# EAGLE design Master (EAGLE 7.5.0)
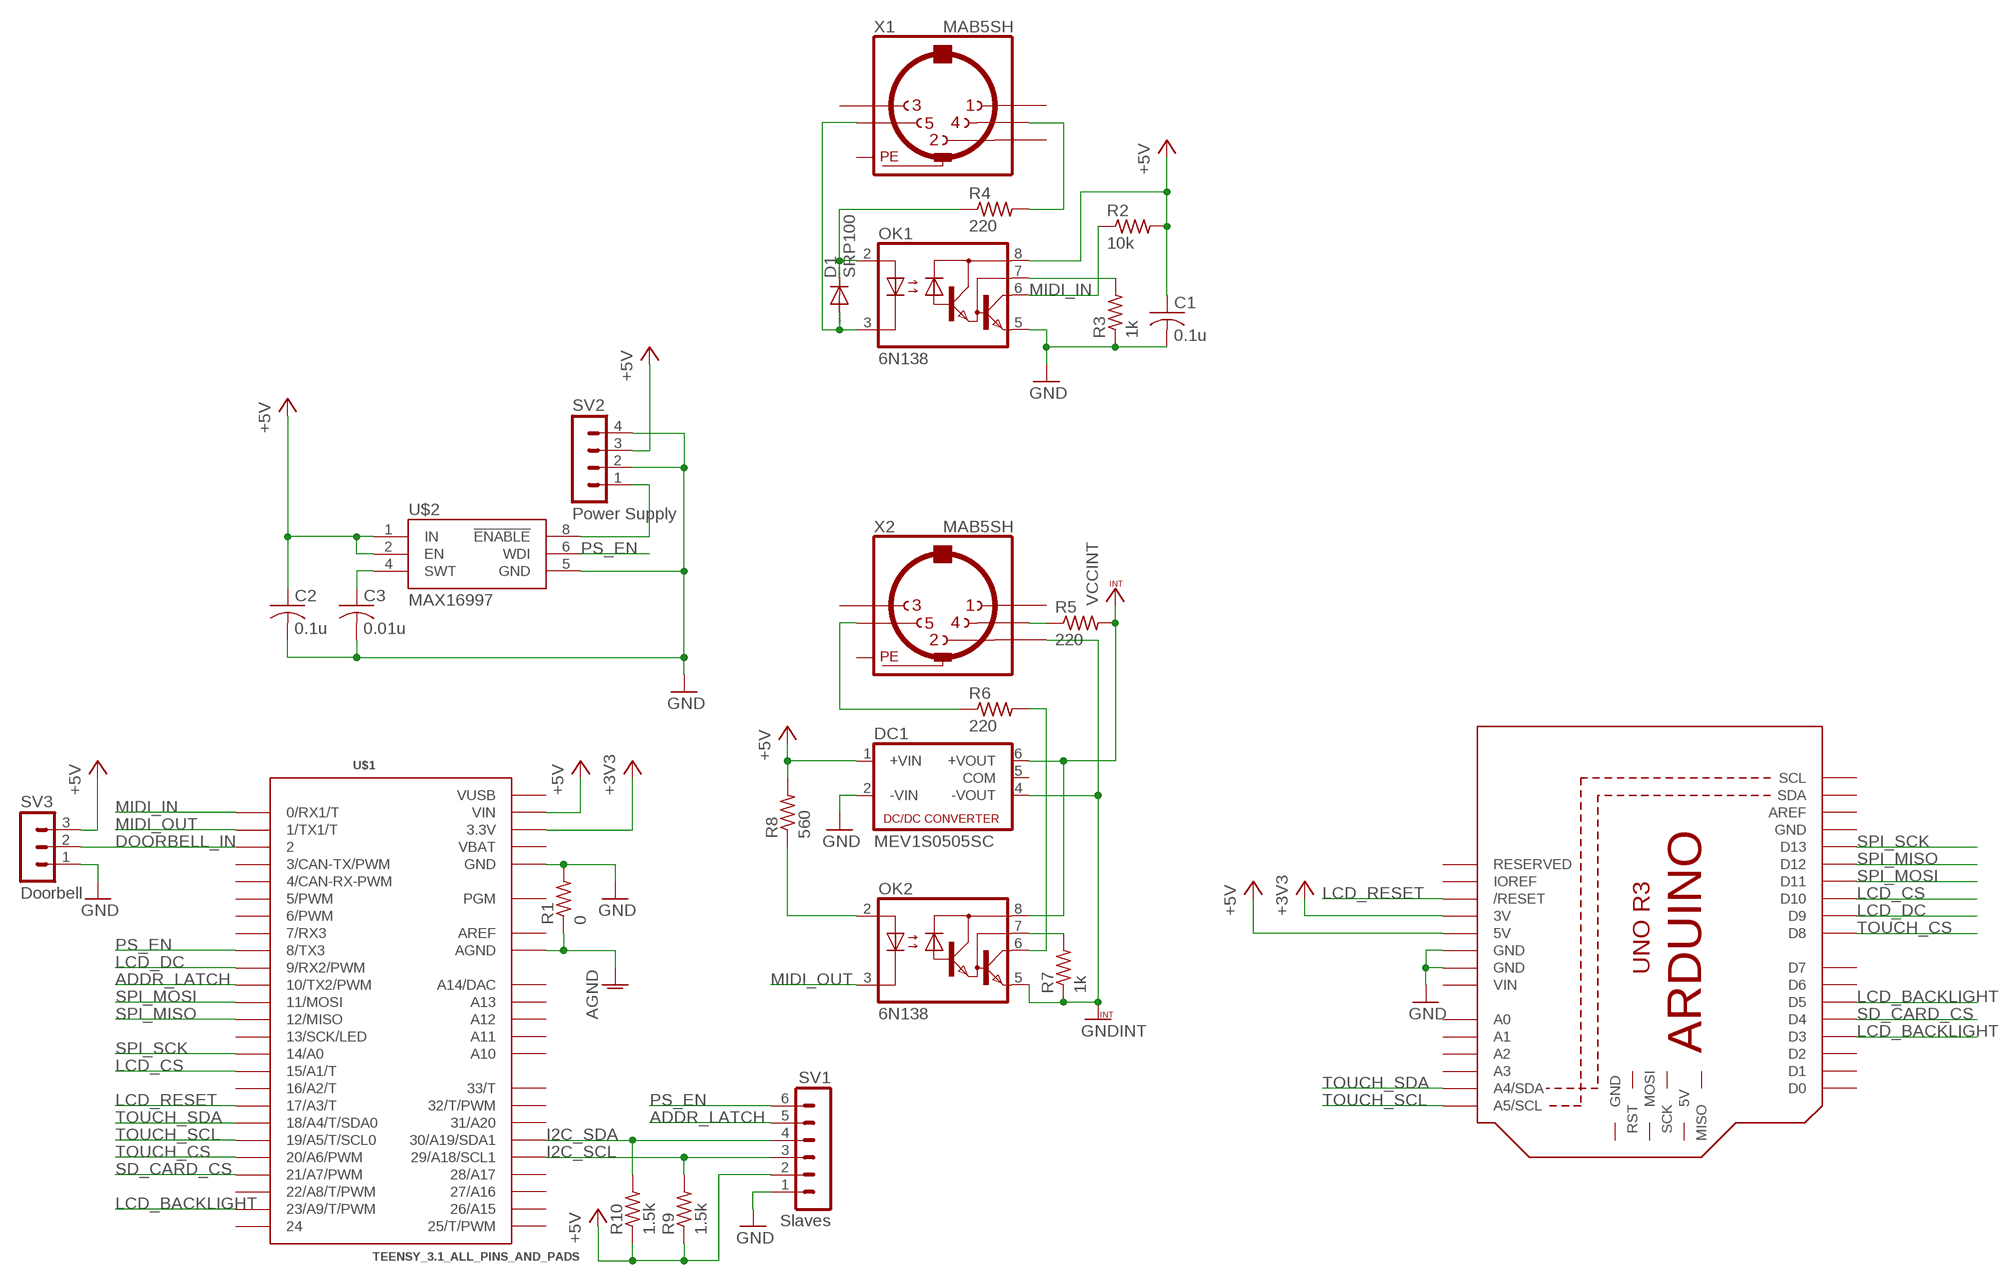
[diagram p0: schematic, sheet 1]

## Parts
C1  0.1u  C-USC0805  [C0805]
C2  0.1u  C-USC0805  [C0805]
C3  0.01u  C-USC0805  [C0805]
D1  SRP100  [DO41-10]
DC1  MEV1S0505SC  NMA  [NMA]
M1  ARDUINO_R3_ICSP_NODIM  [ARDUINOR3_ICSP_NODIM]
OK1  6N138  [DIL08]
OK2  6N138  [DIL08]
R1  0  R-US_R0805  [R0805]
R2  10k  R-US_R0805  [R0805]
R3  1k  R-US_R0805  [R0805]
R4  220  R-US_R0805  [R0805]
R5  220  R-US_R0805  [R0805]
R6  220  R-US_R0805  [R0805]
R7  1k  R-US_R0805  [R0805]
R8  560  R-US_R0805  [R0805]
R9  1.5k  R-US_R0805  [R0805]
R10  1.5k  R-US_R0805  [R0805]
SV1  Slaves  MA06-1  [MA06-1]
SV2  Power Supply  MA04-1  [MA04-1]
SV3  Doorbell  MA03-1  [MA03-1]
U$1  TEENSY_3.1_ALL_PINS_AND_PADS  [TEENSY3_ALL_PINS_&_PADS]
U$2  MAX16997  [UMAX-U8-1]
X1  MAB5SH  [MAB5SH]
X2  MAB5SH  [MAB5SH]

## Nets
+3V3: M1.3V U$1.3.3V U$1.3.3V1(3.3V) U$1.3.3V2(3.3V)
+5V: C1.1 C2.1 DC1.1(+VIN) M1.5V OK1.8(VCC) R2.2 R8.2 R9.1 R10.1 SV1.2 SV2.3 SV3.3 U$1.VIN U$2.1(IN) U$2.2(EN)
ADDR_LATCH: SV1.5 U$1.10(10/TX2/PWM)
AGND: R1.1 U$1.AGND
DOORBELL_IN: SV3.2 U$1.2
GND: C1.2 C2.2 C3.2 DC1.2(-VIN) M1.GND@1(GND) M1.GND@3(GND) OK1.5(GND) R1.2 R3.1 SV1.1 SV2.2 SV2.4 SV3.1 U$1.GND U$1.GND1(GND) U$1.GND2(GND) U$2.5(GND)
GNDINT: DC1.4(-VOUT) OK2.5(GND) R7.1 X2.2
I2C_SCL: R9.2 SV1.3 U$1.29(29/A18/SCL1)
I2C_SDA: R10.2 SV1.4 U$1.30(30/A19/SDA1)
LCD_BACKLIGHT: M1.D3 M1.D5 U$1.23/A9(23/A9/T/PWM)
LCD_CS: M1.D10 U$1.15/A1(15/A1/T)
LCD_DC: M1.D9 U$1.9(9/RX2/PWM)
LCD_RESET: M1.RESET(/RESET) U$1.17/A3(17/A3/T)
MIDI_IN: OK1.6(VO) R2.1 U$1.0(0/RX1/T)
MIDI_OUT: OK2.3(C) U$1.1(1/TX1/T)
N$1: R6.1 X2.5
N$2: OK1.7(VB) R3.2
N$3: D1.C OK1.2(A) R4.1
N$4: R4.2 X1.4
N$5: D1.A OK1.3(C) X1.5
N$6: OK2.6(VO) R6.2
N$7: R5.1 X2.4
N$8: C3.1 U$2.4(SWT)
N$9: OK2.2(A) R8.1
N$10: OK2.7(VB) R7.2
N$11: SV2.1 U$2.8(!ENABLE)
PS_EN: SV1.6 U$1.8(8/TX3) U$2.6(WDI)
SD_CARD_CS: M1.D4 U$1.21/A7(21/A7/PWM)
SPI_MISO: M1.D12 U$1.12(12/MISO)
SPI_MOSI: M1.D11 U$1.11(11/MOSI)
SPI_SCK: M1.D13 U$1.14/A0
TOUCH_CS: M1.D8 U$1.20/A6(20/A6/PWM)
TOUCH_SCL: M1.A5(A5/SCL) U$1.19/A5(19/A5/T/SCL0)
TOUCH_SDA: M1.A4(A4/SDA) U$1.18/A4(18/A4/T/SDA0)
VCCINT: DC1.6(+VOUT) OK2.8(VCC) R5.2
Unconnected: DC1.5(COM) M1.5V_ICSP(5V) M1.A0 M1.A1 M1.A2 M1.A3 M1.AREF M1.D0 M1.D1 M1.D2 M1.D6 M1.D7 M1.GND@2(GND) M1.IOREF M1.MISO M1.MOSI M1.RESERVED M1.RESET_ICSP(RST) M1.SCK M1.SCL M1.SDA U$1.3(3/CAN-TX/PWM) U$1.4(4/CAN-RX-PWM) U$1.5(5/PWM) U$1.6(6/PWM) U$1.7(7/RX3) U$1.13(13/SCK/LED) U$1.16/A2(16/A2/T) U$1.22/A8(22/A8/T/PWM) U$1.24 U$1.25(25/T/PWM) U$1.26(26/A15) U$1.27(27/A16) U$1.28(28/A17) U$1.31(31/A20) U$1.32(32/T/PWM) U$1.33(33/T) U$1.A10 U$1.A11 U$1.A12 U$1.A13 U$1.PGM U$1.RESET/DAC(A14/DAC) X1.1 X1.2 X1.3 X2.1 X2.3

## Power pins joined to a net without a drawn wire
AREF: U$1.AREF
GND: M1.GND
PE: X1.PE X1.PE@(PE) X2.PE X2.PE@(PE)
VBAT: U$1.VBAT
VIN: M1.VIN
VUSB: U$1.VUSB

## Library data of the parts
C1-C3 = resistor:C-US: CAPACITOR, American symbol
D1 = diode:SRP100: DIODE
DC1 = dc-dc-converter:NMA: DC-DC CONVERTER; MF: C & D TECHNOLOGIES, INC; MPN: NMA0515SC; OC_FARNELL: 1021434; OC_NEWARK: 61K3064
M1 = adafruit:ARDUINO_R3_ICSP
OK1 OK2 = optocoupler:6N138: MOTOROLA OPTO COUPLER; MF: VISHAY/TELEFUNKEN; MPN: 6N138; OC_FARNELL: 9860150; OC_NEWARK: 35K5294
R1-R10 = resistor:R-US_: RESISTOR, American symbol
SV1 = con-lstb:MA06-1: PIN HEADER; OC_FARNELL: unknown; OC_NEWARK: unknown
SV2 = con-lstb:MA04-1: PIN HEADER; OC_FARNELL: unknown; OC_NEWARK: unknown
SV3 = con-lstb:MA03-1: PIN HEADER; OC_FARNELL: unknown; OC_NEWARK: unknown
U$1 = Teensy_3_and_LC_Series_Boards_v1.1:TEENSY_3.1_ALL_PINS_AND_PADS: Footprint for Teensy 3.1 or 3.2 board using all pads and all through-holes. Pads need a 2x7 0.1" SMD header.
U$2 = DAVe3283:MAX16997: MAXIM MAX16997 Watchdog; MPN: MAX16997A
X1 X2 = con-hirschmann:MAB5SH: Female CONNECTOR 5 pins 90 deg. with shield, horizontal (DIN 41524); OC_FARNELL: 809883; OC_NEWARK: unknown

## Board
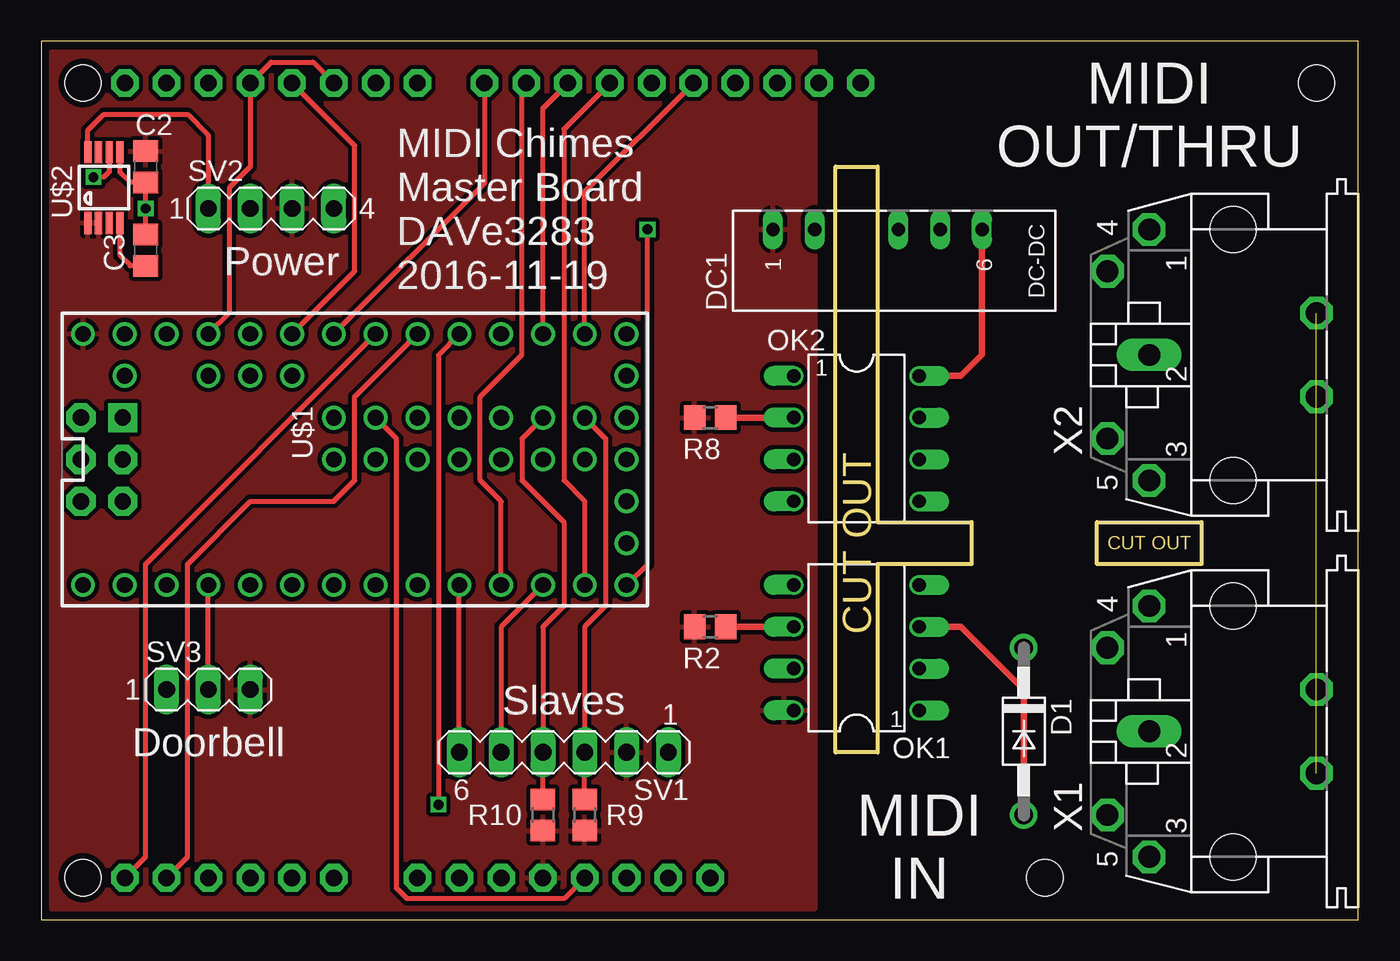
[diagram p1: board, top side]
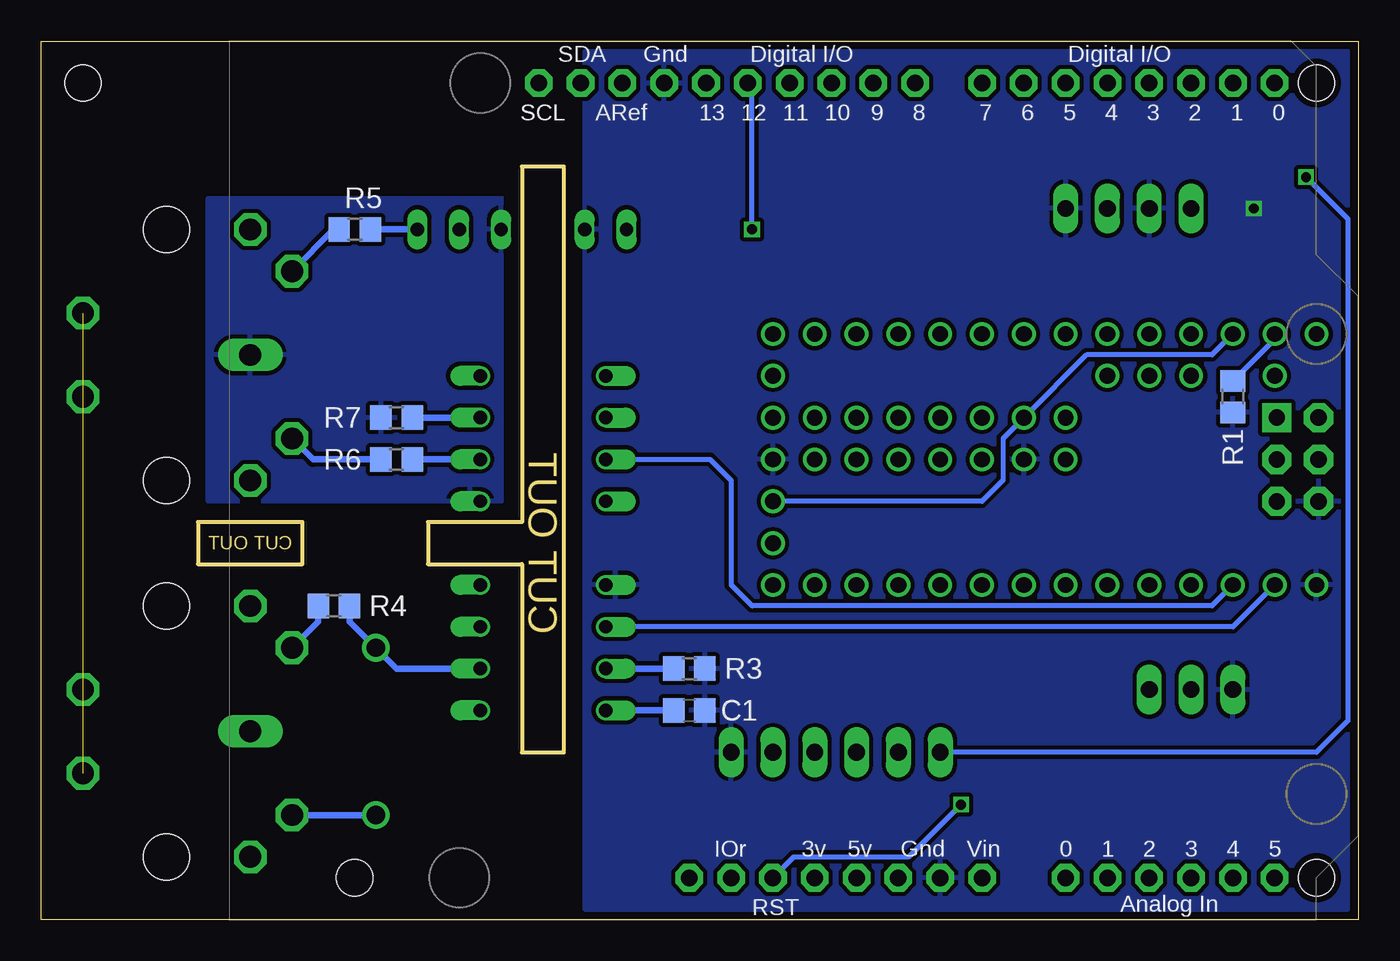
[diagram p2: board, bottom side, seen from below]

Size 80.01 x 53.34 mm. Coordinates in mm from the lower left corner, seen from the top.
Outline: 0,0 80.01,0 80.01,53.34 0,53.34 0,0
Outline: 48.26,45.72 50.8,45.72 50.8,24.13 56.52,24.13 56.52,21.59 50.8,21.59 50.8,10.16 48.26,10.16 48.26,45.72
Outline: 64.14,24.13 70.48,24.13 70.48,21.59 64.14,21.59 64.14,24.13
Copper layers (1*16): Top 0.0356mm / dielectric 1.5011mm / Bottom 0.0356mm
Design rules "OSH_Park": minimum track width 6mil, minimum drill 13mil, track to track 6mil, track to pad 6mil, pad to pad 6mil, via to via 6mil, smd to smd 6mil, copper to edge 15mil, drill to drill 6mil, minimum pad ring 7mil, minimum via ring 7mil, stop-mask expansion 3mil, vias tented up to drill 0mil, thermal gap 10mil
Holes 2.2 mm at 2.54,50.8 2.54,2.54 77.47,50.8 60.96,2.54

### Footprints (pad centres in the part's own frame; a part is rotated, then mirrored left to right if it is on the bottom)
C0805 = smd 1.3 x 1.5: 1 -0.95,0; 2 0.95,0
DO41-10 = drill 1.118: A 5.08,0; C -5.08,0
NMA = drill 0.813 long: 1 0,6.35; 2 0,3.81; 4 0,-1.27; 5 0,-3.81; 6 0,-6.35
ARDUINOR3_ICSP_NODIM = drill 1 pad 1.676 octagon: 3V 35.56,2.54; 5V 38.1,2.54; A0 50.8,2.54; A1 53.34,2.54; A2 55.88,2.54; A3 58.42,2.54; A4 60.96,2.54; A5 63.5,2.54; AREF 23.876,50.8; D0 63.5,50.8; D1 60.96,50.8; D2 58.42,50.8; D3 55.88,50.8; D4 53.34,50.8; D5 50.8,50.8; D6 48.26,50.8; D7 45.72,50.8; D8 41.656,50.8; D9 39.116,50.8; D10 36.576,50.8; D11 34.036,50.8; D12 31.496,50.8; D13 28.956,50.8; GND 26.416,50.8; GND@1 43.18,2.54; GND@2 40.64,2.54; IOREF 30.48,2.54; RESERVED 27.94,2.54; RESET 33.02,2.54; SCL 18.796,50.8; SDA 21.336,50.8; VIN 45.72,2.54 | drill 1 pad 1.778 octagon: 5V_ICSP 66.167,30.48; GND@3 66.167,25.4; MOSI 66.167,27.94; RESET_ICSP 63.627,25.4; SCK 63.627,27.94 | drill 1 pad 1.778 square: MISO 63.627,30.48
DIL08 = drill 0.813 offset: 1 -3.81,-3.81; 2 -1.27,-3.81; 3 1.27,-3.81; 4 3.81,-3.81; 5 3.81,3.81; 6 1.27,3.81; 7 -1.27,3.81; 8 -3.81,3.81
R0805 = smd 1.3 x 1.5: 1 -0.95,0; 2 0.95,0
MA06-1 = drill 1.016 long: 1 -6.35,0; 2 -3.81,0; 3 -1.27,0; 4 1.27,0; 5 3.81,0; 6 6.35,0
MA04-1 = drill 1.016 long: 1 -3.81,0; 2 -1.27,0; 3 1.27,0; 4 3.81,0
MA03-1 = drill 1.016 long: 1 -2.54,0; 2 0,0; 3 2.54,0
TEENSY3_ALL_PINS_&_PADS = drill 0.965: 0 -7.62,13.97; 1 -7.62,11.43; 2 -7.62,8.89; 3 -7.62,6.35; 3.3V 7.62,11.43; 3.3V1 -2.54,-16.51; 3.3V2 2.54,-1.27; 4 -7.62,3.81; 5 -7.62,1.27; 6 -7.62,-1.27; 7 -7.62,-3.81; 8 -7.62,-6.35; 9 -7.62,-8.89; 10 -7.62,-11.43; 11 -7.62,-13.97; 12 -7.62,-16.51; 13 7.62,-16.51; 14/A0 7.62,-13.97; 15/A1 7.62,-11.43; 16/A2 7.62,-8.89; 17/A3 7.62,-6.35; 18/A4 7.62,-3.81; 19/A5 7.62,-1.27; 20/A6 7.62,1.27; 21/A7 7.62,3.81; 22/A8 7.62,6.35; 23/A9 7.62,8.89; 24 0,-3.81; 25 0,-6.35; 26 0,-8.89; 27 0,-11.43; 28 0,-13.97; 29 2.54,-13.97; 30 2.54,-11.43; 31 2.54,-8.89; 32 2.54,-6.35; 33 2.54,-3.81; A10 5.08,6.35; A11 5.08,3.81; A12 0,1.27; A13 2.54,1.27; AGND 7.62,13.97; AREF 5.08,8.89; GND -7.62,16.51; GND1 0,-16.51; GND2 0,-1.27; PGM 2.54,-16.51; RESET/DAC 5.08,-16.51; VBAT -5.08,-16.51; VIN 7.62,16.51; VUSB 5.08,13.97
UMAX-U8-1 = smd 0.45 x 1.35: 1 -0.975,-2.15; 2 -0.325,-2.15; 3 0.325,-2.15; 4 0.975,-2.15; 5 0.975,2.15; 6 0.325,2.15; 7 -0.325,2.15; 8 -0.975,2.15
MAB5SH = drill 1.321 octagon: 1 7.62,5.08; 3 -7.62,5.08; 4 5.08,7.62; 5 -5.08,7.62; PE -2.54,-5.08; PE@ 2.54,-5.08 | drill 1.321 long: 2 0,5.08 | hole 2.794: 7.62,0; -7.62,0

### Placement (x,y rotation side)
C1  40.64,12.7 0 bottom
C2  6.35,45.72 270 top
C3  6.35,40.64 90 top
D1  59.69,11.43 270 top
DC1  50.8,41.91 90 top
M1  68.58,0 0 bottom
OK1  49.53,16.51 90 top
OK2  49.53,29.21 270 top
R1  7.62,31.75 270 bottom
R2  40.64,17.78 180 top
R3  40.64,15.24 180 bottom
R4  62.23,19.05 180 bottom
R5  60.96,41.91 0 bottom
R6  58.42,27.94 0 bottom
R7  58.42,30.48 0 bottom
R8  40.64,30.48 180 top
R9  33.02,6.35 90 top
R10  30.48,6.35 90 top
SV1  31.75,10.16 180 top
SV2  13.97,43.18 0 top
SV3  10.16,13.97 0 top
U$1  19.05,27.94 90 top
U$2  3.81,44.45 0 top
X1  72.39,11.43 90 top
X2  72.39,34.29 90 top

### Tracks (layer width: path | path; a pad name or v marks a point on that pad's centre or on a via)
+3V3
  Top 0.305: U$1.3.3V2 21.59,29.21 21.59,1.91 22.23,1.27 31.75,1.27 M1.3V
  Bottom 0.305: U$1.3.3V 8.89,34.29 16.51,34.29 U$1.3.3V2 21.59,29.21 21.59,26.67 22.86,25.4 U$1.3.3V1
+5V
  Bottom 0.406: C1.1 OK1.8
  pour Top (isolate 0.254): 0.64,52.7 46.99,52.7 46.99,0.64 0.64,0.64
ADDR_LATCH
  Top 0.305: U$1.10 27.94,17.78 SV1.5
AGND
  Bottom 0.305: U$1.AGND 5.08,35.24 R1.1
DOORBELL_IN
  Top 0.305: SV3.2 U$1.2
GND  (via drill 0.6)
  Top 0.305: U$2.5 4.79,45.38 5.39,44.77 C2.2 v6.35,43.18 C3.2
  pour Bottom (isolate 0.254): 0.64,0.64 0.64,52.7 46.99,52.7 46.99,0.64
GNDINT
  pour Bottom (isolate 0.254): 69.85,43.81 52.07,43.81 52.07,25.4 69.85,25.4
I2C_SCL
  Top 0.305: R9.2 SV1.3 33.02,17.78 34.29,19.05 34.29,29.21 U$1.29
I2C_SDA
  Top 0.305: U$1.30 29.21,29.21 29.21,26.67 31.75,24.13 31.75,19.05 30.48,17.78 SV1.4 R10.2
LCD_BACKLIGHT
  Top 0.305: U$1.23/A9 11.43,36.83 11.43,44.45 12.7,45.72 M1.D3 13.97,52.07 16.51,52.07 M1.D5
LCD_CS
  Top 0.305: U$1.15/A1 30.48,49.28 M1.D10
LCD_DC
  Top 0.305: U$1.9 27.94,25.4 26.67,26.67 26.67,31.75 29.21,34.29 29.21,50.55 M1.D9
LCD_RESET  (via drill 0.6)
  Top 0.305: U$1.17/A3 24.13,34.29 v24.13,6.99
  Bottom 0.305: M1.RESET 34.29,3.81 27.3,3.81 v24.13,6.99
MIDI_IN
  Top 0.406: R2.1 OK1.6
  Bottom 0.305: U$1.0 7.62,17.78 OK1.6
MIDI_OUT
  Bottom 0.305: U$1.1 8.89,19.05 36.83,19.05 38.1,20.32 38.1,26.67 39.37,27.94 OK2.3
N$1
  Bottom 0.406: R6.1 63.5,27.94 X2.5
N$2
  Bottom 0.406: R3.2 OK1.7
N$3
  Bottom 0.406: R4.1 61.28,18.1 D1.C 58.42,15.24 OK1.2
N$4
  Bottom 0.406: X1.4 63.18,18.1 R4.2
N$5
  Top 0.406: OK1.3 55.88,17.78 59.69,13.97 D1.A
  Bottom 0.406: X1.5 D1.A
N$6
  Bottom 0.406: R6.2 OK2.6
N$7
  Bottom 0.406: R5.1 62.23,41.91 X2.4
N$8
  Top 0.305: U$2.4 4.79,40.34 5.39,39.73 5.39,39.69 C3.1
N$9
  Top 0.406: R8.1 OK2.2
N$10
  Bottom 0.406: R7.2 OK2.7
N$11
  Top 0.305: U$2.8 2.83,47.92 3.81,48.9 8.89,48.9 10.16,47.62 SV2.1
PE  (3 unrouted)
PS_EN  (via drill 0.6)
  Top 0.305: v3.17,45.09 3.81,45.09 4.13,45.41 U$2.6 | SV1.6 U$1.8
  Bottom 0.305: SV1.6 2.54,10.16 0.64,12.06 0.64,42.55 v3.17,45.09
SD_CARD_CS
  Top 0.305: U$1.21/A7 19.05,39.37 19.05,46.99 M1.D4
SPI_MISO  (via drill 0.6)
  Top 0.305: U$1.12 36.83,21.59 v36.83,41.91
  Bottom 0.305: v36.83,41.91 36.83,50.55 M1.D12
SPI_MOSI
  Top 0.305: U$1.11 33.02,25.4 31.75,26.67 31.75,48.01 M1.D11
SPI_SCK
  Top 0.305: U$1.14/A0 33.02,44.2 M1.D13
TOUCH_CS
  Top 0.305: M1.D8 26.92,44.7 U$1.20/A6
TOUCH_SCL
  Top 0.305: M1.A5 6.35,3.81 6.35,21.59 U$1.19/A5
TOUCH_SDA
  Top 0.305: M1.A4 8.89,3.81 8.89,21.59 12.7,25.4 17.78,25.4 19.05,26.67 19.05,31.75 U$1.18/A4
VCCINT
  Top 0.406: OK2.8 55.88,33.02 57.15,34.29 DC1.6
  Bottom 0.406: R5.2 DC1.6

### Text on the board
Dimension: CUT OUT | CUT OUT
tNames: MIDI / OUT/THRU | MIDI Chimes / Master Board / DAVe3283 / 2016-11-19 | Power | 1 | Slaves | 1 | Doorbell | MIDI / IN